# EAGLE design AlcoTop (EAGLE 6.3)
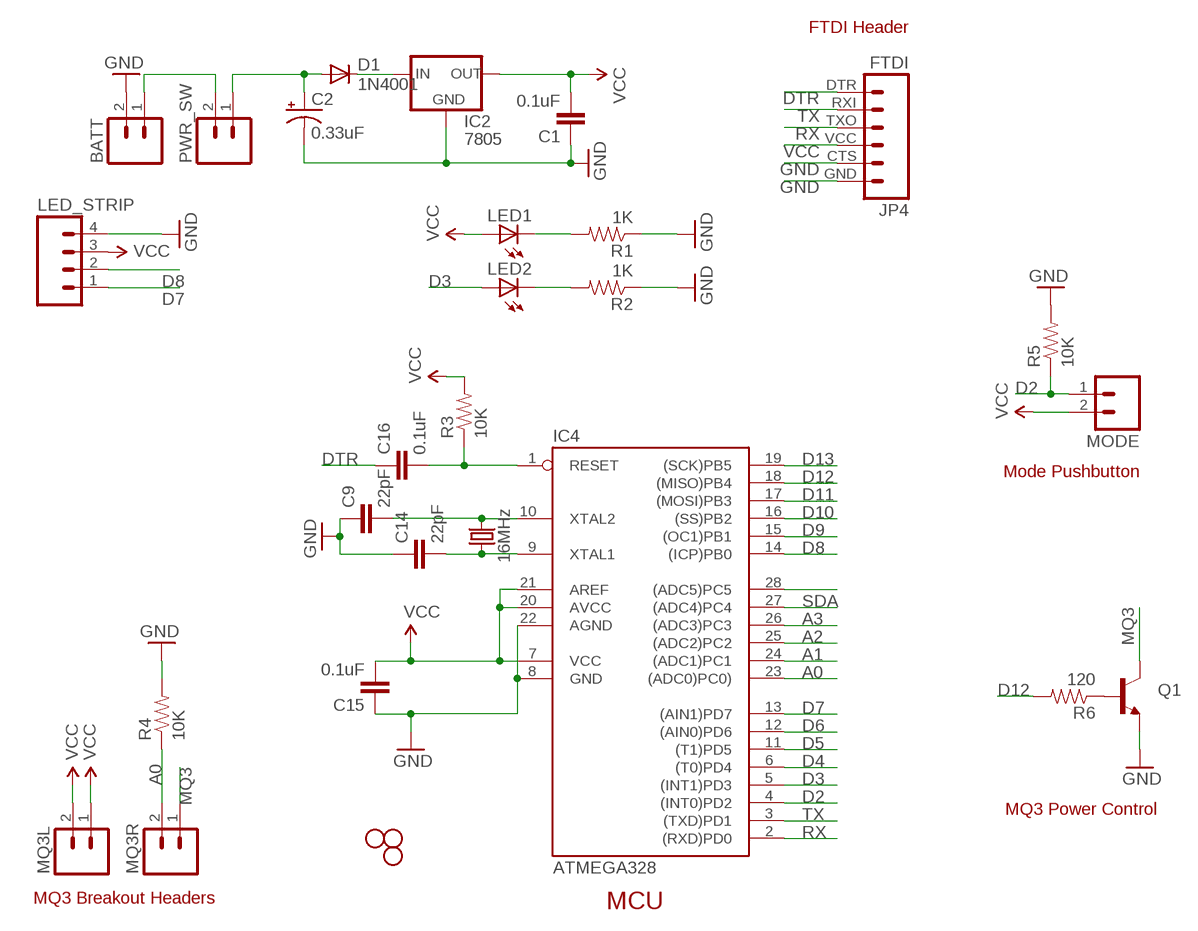
[diagram p0: schematic, sheet 1]

## Parts
BATT  M02LOCK_LONGPADS  [1X02_LOCK_LONGPADS]
C1  0.1uF  CAPPTH2  [CAP-PTH-SMALL2]
C2  0.33uF  CAP_POLPTH2  [CPOL-RADIAL-10UF-25V]
C9  22pF  CAPPTH2  [CAP-PTH-SMALL2]
C14  22pF  CAPPTH2  [CAP-PTH-SMALL2]
C15  0.1uF  CAPPTH2  [CAP-PTH-SMALL2]
C16  0.1uF  CAPPTH2  [CAP-PTH-SMALL2]
D1  1N4001  DIODEPTH  [DIODE-1N4001]
IC2  7805  V_REG_78XXSINK  [TO220-IGO]
IC4  ATMEGA328  AT90S4433P  [DIL28-3]
JP1  STAND-OFF#2  [STAND-OFF-#2]
JP2  STAND-OFF#2  [STAND-OFF-#2]
JP4  FTDI  FTDI_BASICPTH  [FTDI_BASIC]
JP6  STAND-OFF#2  [STAND-OFF-#2]
LED1  LED5MM  [LED5MM]
LED2  LED5MM  [LED5MM]
LED_STRIP  M04LOCK_LONGPADS  [1X04_LOCK_LONGPADS]
MODE  M02LOCK_LONGPADS  [1X02_LOCK_LONGPADS]
MQ3L  M02LOCK_LONGPADS  [1X02_LOCK_LONGPADS]
MQ3R  M02LOCK_LONGPADS  [1X02_LOCK_LONGPADS]
PWR_SW  M02LOCK_LONGPADS  [1X02_LOCK_LONGPADS]
Q1  TRANSISTOR_NPNTO-92-AMMO  [TO-92-AMMO]
R1  1K  RESISTORAXIAL-0.3  [AXIAL-0.3]
R2  1K  RESISTORAXIAL-0.3  [AXIAL-0.3]
R3  10K  RESISTORAXIAL-0.3  [AXIAL-0.3]
R4  10K  RESISTORAXIAL-0.3  [AXIAL-0.3]
R5  10K  RESISTORAXIAL-0.3  [AXIAL-0.3]
R6  120  RESISTORAXIAL-0.3  [AXIAL-0.3]
Y1  16MHz  CRYSTALHC49US  [HC49US]

## Nets
A0: IC4.23((ADC0)PC0)) MQ3R.2 R4.P$1
A1: IC4.24((ADC1)PC1)
A2: IC4.25((ADC2)PC2)
A3: IC4.26((ADC3)PC3)
D2: IC4.4((INT0)PD2) MODE.1 R5.P$1
D3: IC4.5((INT1)PD3) LED2.A
D4: IC4.6((T0)PD4)
D5: IC4.11((T1)PD5)
D6: IC4.12((AIN0)PD6)
D7: IC4.13((AIN1)PD7) LED_STRIP.1
D8: IC4.14((ICP)PB0) LED_STRIP.2
D9: IC4.15((OC1)PB1)
D10: IC4.16((SS)PB2)
D11: IC4.17((MOSI)PB3)
D12: IC4.18((MISO)PB4) R6.P$2
D13: IC4.19((SCK)PB5)
DTR: C16.1 JP4.DTR
GND [power]: BATT.2 C1.1 C2.2(-) C9.1 C14.1 C15.1 IC2.GND IC4.8(GND) IC4.22(AGND) JP4.CTS JP4.GND LED_STRIP.4 Q1.1(E) R1.P$1 R2.P$1 R4.P$2 R5.P$2
MQ3 [power]: MQ3R.1 Q1.3(C)
N$1: LED1.K(C) R1.P$2
N$2: BATT.1 PWR_SW.2
N$3 [power]: C2.1(+) D1.A PWR_SW.1
N$4: LED2.K(C) R2.P$2
N$5: IC4.28((ADC5)PC5)
N$6 [power]: D1.C IC2.IN
N$7: Q1.2(B) R6.P$1
RST: C16.2 IC4.1(RESET) R3.P$1
RX: IC4.2((RXD)PD0) JP4.TXO
SDA: IC4.27((ADC4)PC4)
TX: IC4.3((TXD)PD1) JP4.RXI
VCC [power]: C1.2 C15.2 IC2.OUT IC4.7(VCC) IC4.20(AVCC) IC4.21(AREF) JP4.VCC LED1.A LED_STRIP.3 MODE.2 MQ3L.1 MQ3L.2 R3.P$2
XTAL1: C14.2 IC4.9(XTAL1) Y1.1
XTAL2: C9.2 IC4.10(XTAL2) Y1.2

## Notes on the sheet
- FTDI Header
- Mode Pushbutton
- MQ3 Power Control
- MQ3 Breakout Headers
- MCU

## Library data of the parts
BATT MODE MQ3L MQ3R PWR_SW = Dek:M02: Header 2 Standard 2-pin 0.1" header. Use with straight break away headers (SKU : PRT-00116), right angle break away headers (PRT-00553), swiss pins (PRT-00743), machine pins (PRT-00117), and female headers (PRT-00115). Molex polarized connector foot print use with SKU : PRT-08233 with associated crimp pins and housings.
C1 C9 C14-C16 = Dek:CAP: Capacitor Standard 0603 ceramic capacitor, and 0.1" leaded capacitor.
C2 = Dek:CAP_POL: Capacitor Polarized These are standard SMD and PTH capacitors. Normally 10uF, 47uF, and 100uF in electrolytic and tantalum varieties. Always verify the external diameter of the through hole cap, it varies with capacity, voltage, and manufacturer. The EIA devices should be standard.
D1 = Dek:DIODE: Diode These are standard reverse protection diodes and small signal diodes. SMA package can handle up to about 1A. SOD-323 can handle about 200mA. What the SOD-323 package when ordering, there are some mfgs out there that are 5-pin packages.
IC2 = Dek:V_REG_78XX: Voltage Regulator Standard 7805 5V regulator. IGO (Input Ground Output). Spark Fun Electronics SKU : COM-00107
IC4 = Dek:AT90S4433: MICROCONTROLLER 4 Kbytes FLASH 128 bytes SRAM 256 bytes EEPROM UART 6-channel 10 bit ADC; OC_FARNELL: unknown; OC_NEWARK: unknown
JP1 JP2 JP6 = Dek:STAND-OFF: Stand Off This is the mechanical footprint for a #2 phillips button head screw. Use the keepout ring to avoid running the screw head into surrounding components.
JP4 = Dek:FTDI_BASIC: FTDI Basic: 3.3V and 5V
LED1 LED2 = Dek:LED: LEDs Standard schematic elements and footprints for 5mm, 3mm, 1206, and 0603 sized LEDs. 5mm - Spark Fun Electronics SKU : COM-00529 (and others)
LED_STRIP = Dek:M04: Header 4 Standard 4-pin 0.1" header. Use with straight break away headers (SKU : PRT-00116), right angle break away headers (PRT-00553), swiss pins (PRT-00743), machine pins (PRT-00117), and female headers (PRT-00115). Molex polarized connector foot print use with SKU : PRT-08231 with associated crimp pins and housings. 1MM SMD Version SKU: PRT-10208
Q1 = SparkFun-DiscreteSemi:TRANSISTOR_NPN: Generic NPN BJT. MMBT2222 is the common NPN we use. Double check against datasheet- not all devices are the same!
R1-R6 = Dek:RESISTOR: Resistor Basic schematic elements and footprints for 0603, 1206, and PTH resistors.
Y1 = Dek:CRYSTAL: Various standard crystals. Proven footprints. Spark Fun Electronics SKU : COM-00534

## Net classes
2 old_power: width 0.813 mm, clearance 0.508 mm

## Board
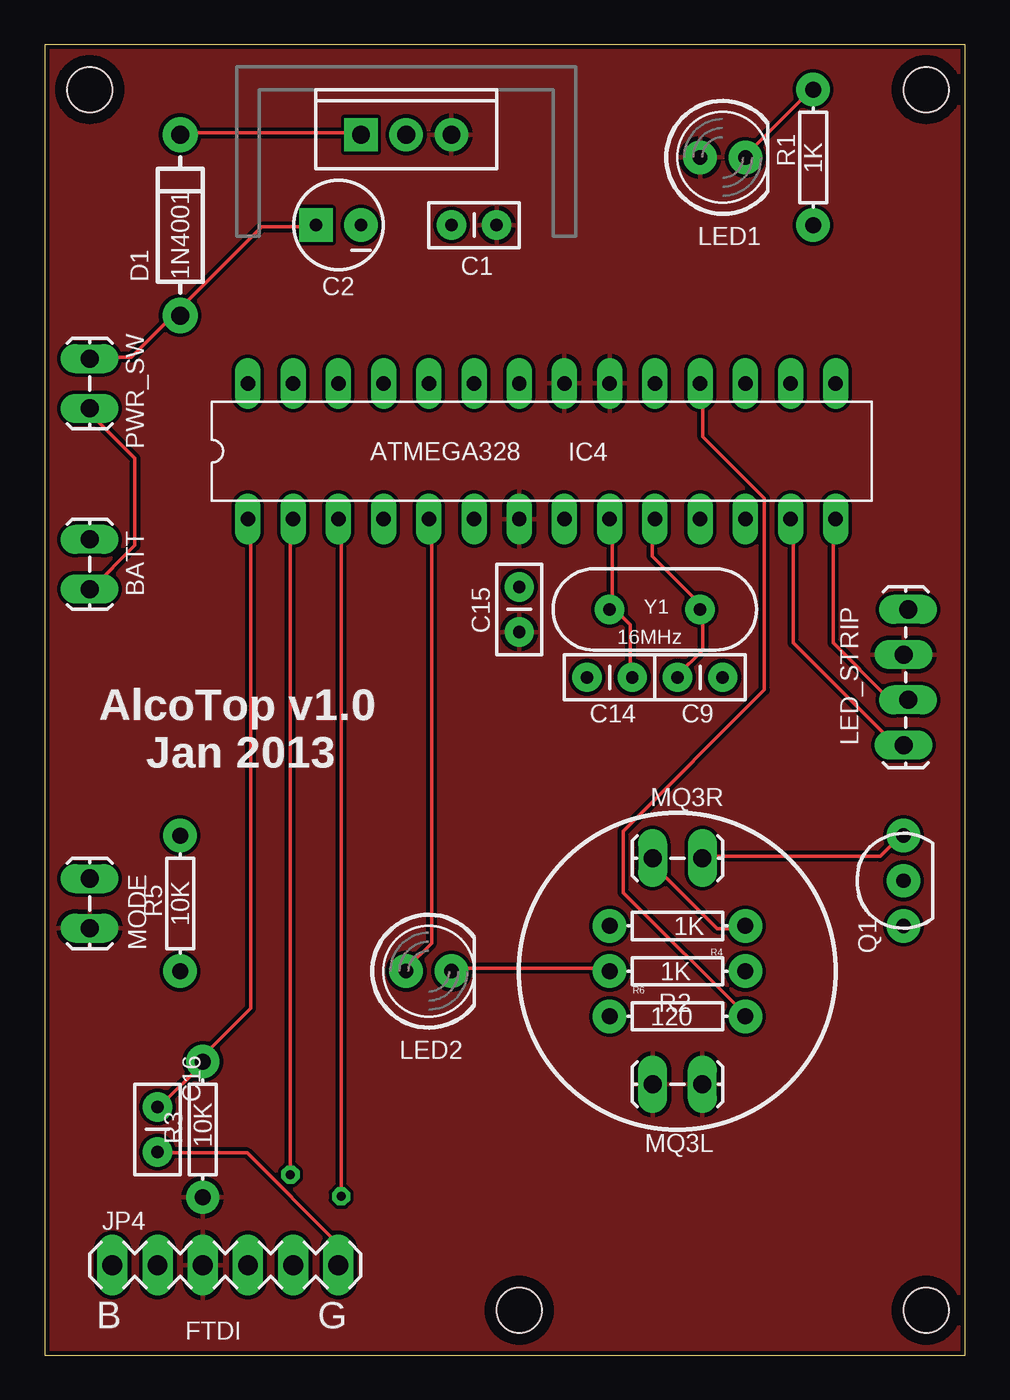
[diagram p1: board, top side]
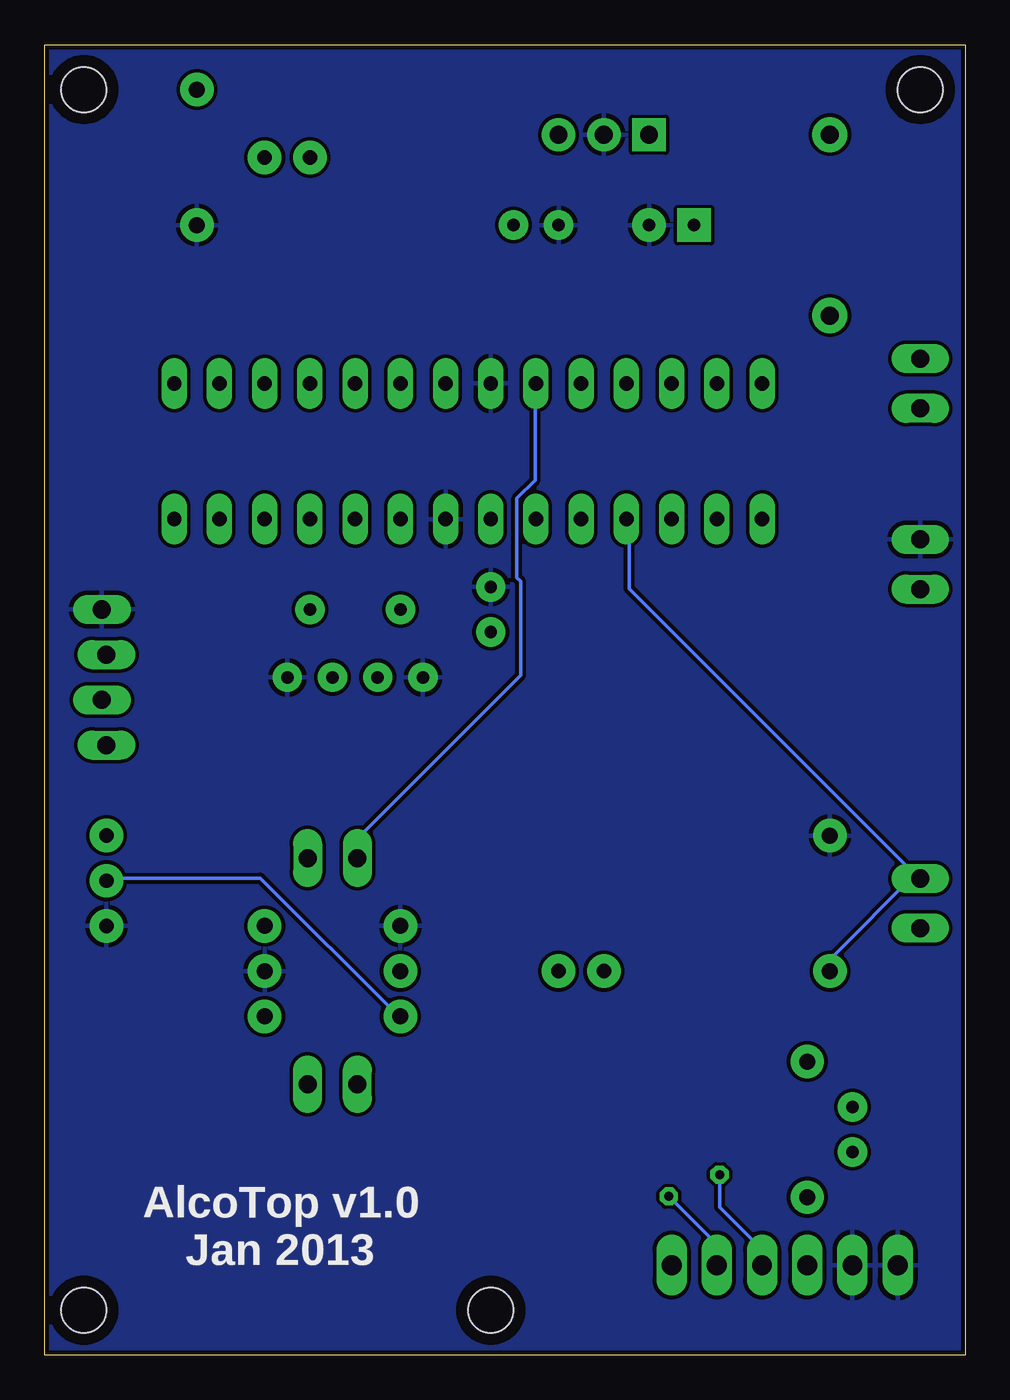
[diagram p2: board, bottom side, seen from below]

Size 51.74 x 73.65 mm. Coordinates in mm from the lower left corner, seen from the top.
Outline: 0,0 51.74,0 51.74,73.65 0,73.65 0,0
Copper layers (1*16): Top 0.035mm / dielectric 1.5mm / Bottom 0.035mm
Design rules "SparkFun": minimum track width 8mil, minimum drill 20mil, track to track 8mil, track to pad 8mil, pad to pad 8mil, via to via 8mil, smd to smd 8mil, copper to edge 10mil, drill to drill 8mil, minimum pad ring 12mil, minimum via ring 10mil, stop-mask expansion 4mil, vias tented up to drill 25mil, thermal gap 10mil

### Footprints (pad centres in the part's own frame; a part is rotated, then mirrored left to right if it is on the bottom)
1X02_LOCK_LONGPADS = drill 1.016 long: 1 -0.127,0; 2 2.667,0
CAP-PTH-SMALL2 = drill 0.7 pad 1.651: 1 0,0; 2 2.54,0
CPOL-RADIAL-10UF-25V = drill 0.7 pad 1.88 square: 1 1.27,0 | drill 0.7 pad 1.88: 2 -1.27,0
DIODE-1N4001 = drill 1 pad 1.981: A -5.08,0; C 5.08,0
TO220-IGO = drill 1 pad 1.88: GND 0,0; OUT 2.54,0 | drill 1 pad 1.88 square: IN -2.54,0
DIL28-3 = drill 0.813 long: 1 -16.51,-3.81; 2 -13.97,-3.81; 3 -11.43,-3.81; 4 -8.89,-3.81; 5 -6.35,-3.81; 6 -3.81,-3.81; 7 -1.27,-3.81; 8 1.27,-3.81; 9 3.81,-3.81; 10 6.35,-3.81; 11 8.89,-3.81; 12 11.43,-3.81; 13 13.97,-3.81; 14 16.51,-3.81; 15 16.51,3.81; 16 13.97,3.81; 17 11.43,3.81; 18 8.89,3.81; 19 6.35,3.81; 20 3.81,3.81; 21 1.27,3.81; 22 -1.27,3.81; 23 -3.81,3.81; 24 -6.35,3.81; 25 -8.89,3.81; 26 -11.43,3.81; 27 -13.97,3.81; 28 -16.51,3.81
STAND-OFF-#2 = hole 2.54: 0,0
FTDI_BASIC = drill 1.118 long: CTS 10.16,0; DTR 0,0; GND 12.7,0; RXI 2.54,0; TXO 5.08,0; VCC 7.62,0
LED5MM = drill 0.813 pad 1.88: A -1.27,0; K 1.27,0
1X04_LOCK_LONGPADS = drill 1.016 long: 1 0,0; 2 2.54,-0.254; 3 5.08,0; 4 7.62,-0.254
TO-92-AMMO = drill 0.813 pad 1.88: 1 -2.54,0; 2 0,0; 3 2.54,0
AXIAL-0.3 = drill 0.9 pad 1.88: P$1 -3.81,0; P$2 3.81,0
HC49US = drill 0.7 pad 1.651: 1 -2.54,0; 2 2.54,0

### Placement (x,y rotation side)
BATT  2.54,43.18 90 top
C1  22.86,63.5 0 top
C2  16.51,63.5 180 top
C9  38.1,38.1 180 top
C14  30.48,38.1 0 top
C15  26.67,43.18 270 top
C16  6.35,11.43 90 top
D1  7.62,63.5 90 top
IC2  20.32,68.58 0 top
IC4  27.94,50.8 0 top
JP1  49.53,71.12 0 top
JP2  2.54,71.12 0 top
JP3  STAND-OFF#2  [STAND-OFF-#2]  49.53,2.54 0 top
JP4  16.51,5.08 180 top
JP6  26.67,2.54 0 top
LED1  38.1,67.31 0 top
LED2  21.59,21.59 0 top
LED_STRIP  48.26,34.29 90 top
MODE  2.54,26.67 270 top
MQ3L  34.29,15.24 0 top
MQ3R  36.83,27.94 180 top
PWR_SW  2.54,55.88 270 top
Q1  48.26,26.67 90 top
R1  43.18,67.31 90 top
R2  35.56,21.59 180 top
R3  8.89,12.7 270 top
R4  1K  [AXIAL-0.3]  35.56,24.13 180 top
R5  7.62,25.4 90 top
R6  35.56,19.05 0 top
Y1  34.29,41.91 0 top

### Tracks (layer width: path | path; a pad name or v marks a point on that pad's centre or on a via)
A0
  Top 0.203: R4.P$1 39.22,23.98 37.8,23.98 34.34,27.43 34.34,27.84 MQ3R.2
  Bottom 0.203: IC4.23 24.18,54.46 24.18,49.17 25.2,48.16 25.2,43.69 24.99,43.48 24.99,38.2 34.14,29.06 34.14,28.04 MQ3R.2
D2
  Bottom 0.203: 2.85,27.03 2.64,26.82 MODE.1 2.85,27.03 | 2.85,27.03 18.9,43.08 18.9,46.94 IC4.4 | 2.85,27.03 7.52,22.35 7.52,21.74 R5.P$1
D3
  Top 0.203: IC4.5 21.74,46.94 21.74,23.16 20.32,21.74 LED2.A
D7
  Top 0.203: IC4.13 42.06,46.94 42.06,40.03 47.75,34.34 48.16,34.34 LED_STRIP.1
D8
  Top 0.203: IC4.14 44.3,46.94 44.3,40.03 47.35,36.98 48.36,36.98 LED_STRIP.2
D12
  Top 0.203: IC4.18 36.98,54.46 36.98,51.61 40.44,48.16 40.44,37.39 32.51,29.46 32.51,26.01 39.42,19.1 R6.P$2
DTR
  Top 0.203: C16.1 6.5,11.38 11.38,11.38 16.46,6.3 16.46,5.08 JP4.DTR
GND
  pour Bottom: -1.27,74.93 53.34,74.93 53.34,-1.27 -1.27,-1.27
MQ3
  Top 0.203: MQ3R.1 36.98,28.04 46.94,28.04 48.16,29.26 Q1.3
N$1
  Top 0.203: LED1.K 39.42,67.46 43.08,71.12 R1.P$2
N$2
  Top 0.203: BATT.1 2.64,43.08 5.08,45.52 5.08,50.39 2.44,53.03 PWR_SW.2
N$3
  Top 0.203: 7.11,58.32 4.88,56.08 2.64,56.08 PWR_SW.1 | 7.11,58.32 7.52,58.32 D1.A 7.11,58.32 | 7.11,58.32 12.19,63.4 15.24,63.4 C2.1
N$4
  Top 0.203: LED2.K 22.96,21.74 31.7,21.74 R2.P$2
N$6
  Top 0.203: IC2.IN 17.68,68.68 7.72,68.68 D1.C
N$7
  Bottom 0.203: R6.P$1 31.9,19.1 39.62,26.82 48.16,26.82 Q1.2
RST
  Top 0.203: IC4.1 11.58,46.94 11.58,19.51 8.74,16.66 R3.P$1 8.94,16.46 6.5,14.02 C16.2
RX  (via drill 0.51)
  Top 0.203: v13.82,10.16 13.82,46.94 IC4.2
  Bottom 0.203: v13.82,10.16 13.82,8.33 11.58,6.1 11.58,5.08 JP4.TXO
TX  (via drill 0.51)
  Top 0.203: v16.66,8.94 16.66,46.94 IC4.3
  Bottom 0.203: v16.66,8.94 14.02,6.3 14.02,5.08 JP4.RXI
VCC
  pour Top: -1.27,73.66 54.61,73.66 54.61,-1.27 -1.27,-1.27
XTAL1
  Top 0.203: 31.9,42.06 31.9,46.94 IC4.9 | 31.9,42.06 32.92,41.05 32.92,38.2 C14.2 | 31.9,42.06 Y1.1
XTAL2
  Top 0.203: IC4.10 34.14,46.94 34.14,44.91 36.98,42.06 Y1.2 36.98,41.86 36.98,39.62 35.56,38.2 C9.2

### Text on the board
tPlace: AlcoTop v1.0 | Jan 2013
bPlace: AlcoTop v1.0 | Jan 2013